# Altium schematic sheet P06 Power&GND of Hi3519.SchDoc
size 420 x 297 mm
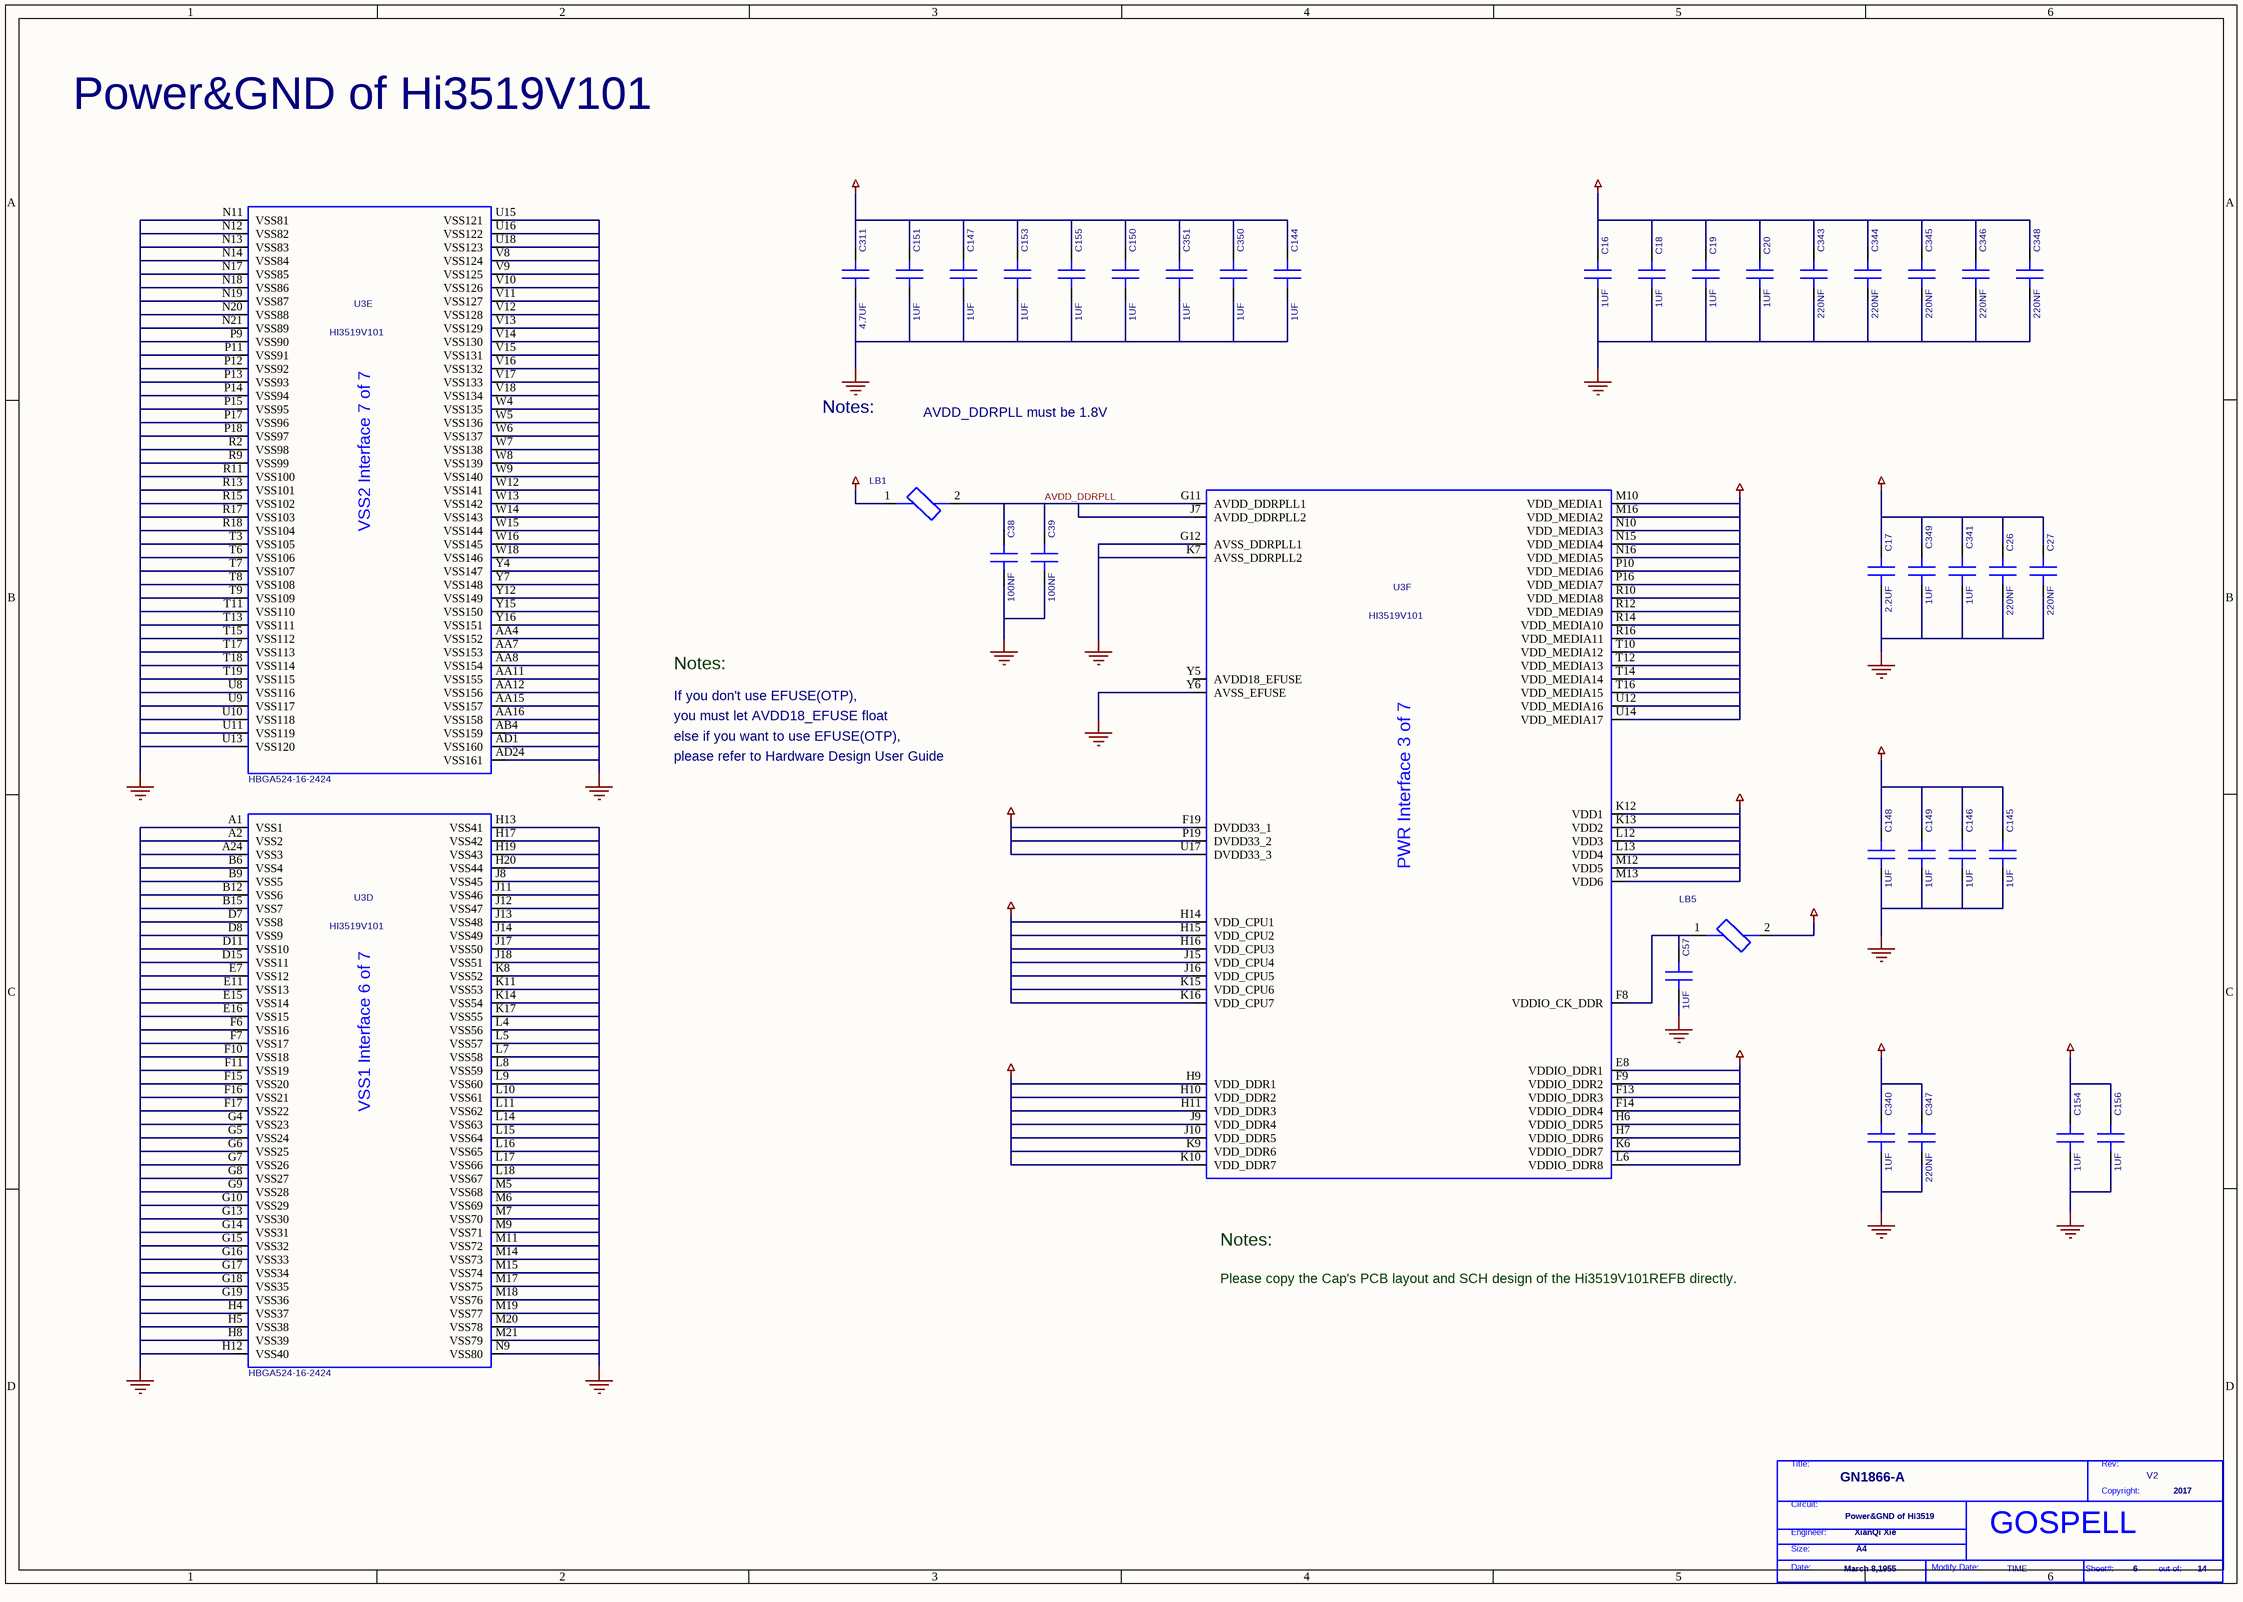
[diagram p0: P06 Power&GND of Hi3519.SchDoc]

## Parts
*  Page Modify Date: TIME  Engineer: XianQi Xie  Copyright: 2017  Title: GN1866-A  RevCode: V2  Page Size: A4  Page Create Date: March 8,1955  Page Number: 6  Page Count: 14  Doc: Power&GND of Hi3519  (hidden comment: GOSPELL)  (graphical)
C16  1UF  [HSC0201]
C17  2.2UF  [SC0402]
C18  1UF  [HSC0201]
C19  1UF  [HSC0201]
C20  1UF  [HSC0201]
C26  220NF  [HSC0201]
C27  220NF  [HSC0201]
C38  100NF  [HSC0201]
C39  100NF  [HSC0201]
C57  1UF  [HSC0201]
C144  1UF  [HSC0201]
C145  1UF  [HSC0201]
C146  1UF  [HSC0201]
C147  1UF  [HSC0201]
C148  1UF  [HSC0201]
C149  1UF  [HSC0201]
C150  1UF  [HSC0201]
C151  1UF  [HSC0201]
C153  1UF  [HSC0201]
C154  1UF  [HSC0201]
C155  1UF  [HSC0201]
C156  1UF  [HSC0201]
C311  4.7UF  [SC0402]
C340  1UF  [HSC0201]
C341  1UF  [HSC0201]
C343  220NF  [HSC0201]
C344  220NF  [HSC0201]
C345  220NF  [HSC0201]
C346  220NF  [HSC0201]
C347  220NF  [HSC0201]
C348  220NF  [HSC0201]
C349  1UF  [HSC0201]
C350  1UF  [HSC0201]
C351  1UF  [HSC0201]
LB1  LB  [HSL0201-TB]  (value not drawn)
LB5  LB  [HSL0201-TB]  (value not drawn)
U3  DEVICE: HI3519V101  [HBGA524-16-2424]  (hidden comment: HI3519V101_PER)  (parts D,E,F of 7)

## Nets
1V8: LB1.1
1V35/1V5: C144.1(A) C147.1(A) C150.1(A) C151.1(A) C153.1(A) C155.1(A) C311.1(A) C350.1(A) C351.1(A) LB5.2 U3.E8(VDDIO_DDR1) U3.F9(VDDIO_DDR2) U3.F13(VDDIO_DDR3) U3.F14(VDDIO_DDR4) U3.H6(VDDIO_DDR5) U3.H7(VDDIO_DDR6) U3.K6(VDDIO_DDR7) U3.L6(VDDIO_DDR8)
3V3: C145.1(A) C146.1(A) C148.1(A) C149.1(A) U3.F19(DVDD33_1) U3.P19(DVDD33_2) U3.U17(DVDD33_3)
GND: C16.2(B) C17.2(B) C18.2(B) C19.2(B) C20.2(B) C26.2(B) C27.2(B) C38.2(B) C39.2(B) C57.2(B) C144.2(B) C145.2(B) C146.2(B) C147.2(B) C148.2(B) C149.2(B) C150.2(B) C151.2(B) C153.2(B) C154.2(B) C155.2(B) C156.2(B) C311.2(B) C340.2(B) C341.2(B) C343.2(B) C344.2(B) C345.2(B) C346.2(B) C347.2(B) C348.2(B) C349.2(B) C350.2(B) C351.2(B) U3.A1(VSS1) U3.A2(VSS2) U3.A24(VSS3) U3.AA4(VSS152) U3.AA7(VSS153) U3.AA8(VSS154) U3.AA11(VSS155) U3.AA12(VSS156) U3.AA15(VSS157) U3.AA16(VSS158) U3.AB4(VSS159) U3.AD1(VSS160) U3.AD24(VSS161) U3.B6(VSS4) U3.B9(VSS5) U3.B12(VSS6) U3.B15(VSS7) U3.D7(VSS8) U3.D8(VSS9) U3.D11(VSS10) U3.D15(VSS11) U3.E7(VSS12) U3.E11(VSS13) U3.E15(VSS14) U3.E16(VSS15) U3.F6(VSS16) U3.F7(VSS17) U3.F10(VSS18) U3.F11(VSS19) U3.F15(VSS20) U3.F16(VSS21) U3.F17(VSS22) U3.G4(VSS23) U3.G5(VSS24) U3.G6(VSS25) U3.G7(VSS26) U3.G8(VSS27) U3.G9(VSS28) U3.G10(VSS29) U3.G12(AVSS_DDRPLL1) U3.G13(VSS30) U3.G14(VSS31) U3.G15(VSS32) U3.G16(VSS33) U3.G17(VSS34) U3.G18(VSS35) U3.G19(VSS36) U3.H4(VSS37) U3.H5(VSS38) U3.H8(VSS39) U3.H12(VSS40) U3.H13(VSS41) U3.H17(VSS42) U3.H19(VSS43) U3.H20(VSS44) U3.J8(VSS45) U3.J11(VSS46) U3.J12(VSS47) U3.J13(VSS48) U3.J14(VSS49) U3.J17(VSS50) U3.J18(VSS51) U3.K7(AVSS_DDRPLL2) U3.K8(VSS52) U3.K11(VSS53) U3.K14(VSS54) U3.K17(VSS55) U3.L4(VSS56) U3.L5(VSS57) U3.L7(VSS58) U3.L8(VSS59) U3.L9(VSS60) U3.L10(VSS61) U3.L11(VSS62) U3.L14(VSS63) U3.L15(VSS64) U3.L16(VSS65) U3.L17(VSS66) U3.L18(VSS67) U3.M5(VSS68) U3.M6(VSS69) U3.M7(VSS70) U3.M9(VSS71) U3.M11(VSS72) U3.M14(VSS73) U3.M15(VSS74) U3.M17(VSS75) U3.M18(VSS76) U3.M19(VSS77) U3.M20(VSS78) U3.M21(VSS79) U3.N9(VSS80) U3.N11(VSS81) U3.N12(VSS82) U3.N13(VSS83) U3.N14(VSS84) U3.N17(VSS85) U3.N18(VSS86) U3.N19(VSS87) U3.N20(VSS88) U3.N21(VSS89) U3.P9(VSS90) U3.P11(VSS91) U3.P12(VSS92) U3.P13(VSS93) U3.P14(VSS94) U3.P15(VSS95) U3.P17(VSS96) U3.P18(VSS97) U3.R2(VSS98) U3.R9(VSS99) U3.R11(VSS100) U3.R13(VSS101) U3.R15(VSS102) U3.R17(VSS103) U3.R18(VSS104) U3.T3(VSS105) U3.T6(VSS106) U3.T7(VSS107) U3.T8(VSS108) U3.T9(VSS109) U3.T11(VSS110) U3.T13(VSS111) U3.T15(VSS112) U3.T17(VSS113) U3.T18(VSS114) U3.T19(VSS115) U3.U8(VSS116) U3.U9(VSS117) U3.U10(VSS118) U3.U11(VSS119) U3.U13(VSS120) U3.U15(VSS121) U3.U16(VSS122) U3.U18(VSS123) U3.V8(VSS124) U3.V9(VSS125) U3.V10(VSS126) U3.V11(VSS127) U3.V12(VSS128) U3.V13(VSS129) U3.V14(VSS130) U3.V15(VSS131) U3.V16(VSS132) U3.V17(VSS133) U3.V18(VSS134) U3.W4(VSS135) U3.W5(VSS136) U3.W6(VSS137) U3.W7(VSS138) U3.W8(VSS139) U3.W9(VSS140) U3.W12(VSS141) U3.W13(VSS142) U3.W14(VSS143) U3.W15(VSS144) U3.W16(VSS145) U3.W18(VSS146) U3.Y4(VSS147) U3.Y6(AVSS_EFUSE) U3.Y7(VSS148) U3.Y12(VSS149) U3.Y15(VSS150) U3.Y16(VSS151)
VCC_CPU_CORE: C17.1(A) C26.1(A) C27.1(A) C341.1(A) C349.1(A) U3.H14(VDD_CPU1) U3.H15(VDD_CPU2) U3.H16(VDD_CPU3) U3.J15(VDD_CPU4) U3.J16(VDD_CPU5) U3.K15(VDD_CPU6) U3.K16(VDD_CPU7)
VCC_MEDIA_CORE: C16.1(A) C18.1(A) C19.1(A) C20.1(A) C343.1(A) C344.1(A) C345.1(A) C346.1(A) C348.1(A) U3.M10(VDD_MEDIA1) U3.M16(VDD_MEDIA2) U3.N10(VDD_MEDIA3) U3.N15(VDD_MEDIA4) U3.N16(VDD_MEDIA5) U3.P10(VDD_MEDIA6) U3.P16(VDD_MEDIA7) U3.R10(VDD_MEDIA8) U3.R12(VDD_MEDIA9) U3.R14(VDD_MEDIA10) U3.R16(VDD_MEDIA11) U3.T10(VDD_MEDIA12) U3.T12(VDD_MEDIA13) U3.T14(VDD_MEDIA14) U3.T16(VDD_MEDIA15) U3.U12(VDD_MEDIA16) U3.U14(VDD_MEDIA17)
VCC_VDD_DDR_CORE: C154.1(A) C156.1(A) C340.1(A) C347.1(A) U3.H9(VDD_DDR1) U3.H10(VDD_DDR2) U3.H11(VDD_DDR3) U3.J9(VDD_DDR4) U3.J10(VDD_DDR5) U3.K9(VDD_DDR6) U3.K10(VDD_DDR7) U3.K12(VDD1) U3.K13(VDD2) U3.L12(VDD3) U3.L13(VDD4) U3.M12(VDD5) U3.M13(VDD6)
AVDD_DDRPLL: C38.1(A) C39.1(A) LB1.2 U3.G11(AVDD_DDRPLL1) U3.J7(AVDD_DDRPLL2)
NetC57_1: C57.1(A) LB5.1 U3.F8(VDDIO_CK_DDR)

Not connected (* = marked no-connect by the designer): U3 Y5(AVDD18_EFUSE)

## Notes on the sheet
- Power&GND of Hi3519V101
- Notes:
- AVDD_DDRPLL must be 1.8V
- you must let AVDD18_EFUSE float
- If you don't use EFUSE(OTP),
- please refer to Hardware Design User Guide
- else if you want to use EFUSE(OTP),
- Please copy the Cap's PCB layout and SCH design of the Hi3519V101REFB directly.
- (in symbol GOSPELL) Title:; Rev:; Copyright:; Circuit:; Engineer:; Size:; Date:; Modify Date:; Sheet#:; out of:
- (in symbol HI3519V101_PER_2, part D) VSS1 Interface 6 of 7
- (in symbol HI3519V101_PER_2, part E) VSS2 Interface 7 of 7
- (in symbol HI3519V101_PER_2, part F) PWR Interface 3 of 7

## Library data of the parts
C16 C18 C20 C340 = C_0_Dup2: PARTS: 1; OriginalSymbolOrigin: (0,30); DEVICE: CM03X5R105M06AH_A; LEVEL: STD; PINSWAP: (A,B); %208%%161%%192%%224%%195%%251%%179%%198%: SMD陶瓷电容; COMPONENT_HIGH_MAX: 0.35MM; %182%%238%%182%%168%%185%%164%%215%%247%%181%%231%%209%%185%(V): 6.3; %195%%232%%202%%246%: SMD陶瓷电容-4V-1000NF-+/-20%-X5R-0201(0.65MM*0.35MM*0.35MM)-终端专用; CODE: 8071128; GVALUE: C  4V  1uF +80%~-20%  X5R 0201(0.65MM*0.35MM*0.35MM); PKG_TYPE: HSC0201
C17 = C_0_Dup2: PARTS: 1; OriginalSymbolOrigin: (0,30); DEVICE: GRM155R60J225ME15D; LEVEL: STD; PINSWAP: (A,B); %208%%161%%192%%224%%195%%251%%179%%198%: SMD陶瓷电容; COMPONENT_HIGH_MAX: 0.6MM; %182%%238%%182%%168%%185%%164%%215%%247%%181%%231%%209%%185%(V): 6.3; %195%%232%%202%%246%: SMD陶瓷电容-6.3V-2200NF-+/-20%-X5R-0402-TS16949; CODE: 8070667; GVALUE: C  6.3V  2.2uF +80%~-20%  X5R 0402; PKG_TYPE: SC0402
C19 = C_0_Dup2: PARTS: 1; OriginalSymbolOrigin: (0,30); DEVICE: CM03X5R105M06AH_A; LEVEL: STD; PINSWAP: (A,B); GVALUE: C  4V  1uF +80%~-20%  X5R 0201(0.65MM*0.35MM*0.35MM); %208%%161%%192%%224%%195%%251%%179%%198%: SMD陶瓷电容; COMPONENT_HIGH_MAX: 0.35MM; %182%%238%%182%%168%%185%%164%%215%%247%%181%%231%%209%%185%(V): 6.3; %195%%232%%202%%246%: SMD陶瓷电容-4V-1000NF-+/-20%-X5R-0201(0.65MM*0.35MM*0.35MM)-终端专用; CODE: 8071128; PKG_TYPE: HSC0201
C26 C344 C346 = C_0_Dup2: PARTS: 1; OriginalSymbolOrigin: (0,30); DEVICE: GRM033R60J104KE19D; LEVEL: STD; PINSWAP: (A,B); CODE: 8070752; %195%%232%%202%%246%: SMD陶瓷电容-6.3V-220NF-+/-20%-X5R-0201-终端专用-终端专用; %182%%238%%182%%168%%185%%164%%215%%247%%181%%231%%209%%185%(V): 6.3; COMPONENT_HIGH_MAX: 0.33MM; %208%%161%%192%%224%%195%%251%%179%%198%: SMD陶瓷电容; GVALUE: C  6.3V  0.22uF +80%~-20%  X5R 0201; PKG_TYPE: HSC0201
C27 C343 C345 C347 C348 = C_0_Dup2: PARTS: 1; OriginalSymbolOrigin: (0,30); DEVICE: GRM033R60J104KE19D; LEVEL: STD; PINSWAP: (A,B); %208%%161%%192%%224%%195%%251%%179%%198%: SMD陶瓷电容; COMPONENT_HIGH_MAX: 0.33MM; %182%%238%%182%%168%%185%%164%%215%%247%%181%%231%%209%%185%(V): 6.3; %195%%232%%202%%246%: SMD陶瓷电容-6.3V-220NF-+/-20%-X5R-0201-终端专用-终端专用; CODE: 8070752; GVALUE: C  6.3V  0.22uF +80%~-20%  X5R 0201; PKG_TYPE: HSC0201
C38 = C_0_Dup2: PARTS: 1; OriginalSymbolOrigin: (0,30); DEVICE: GRM033R60J104KE19D; LEVEL: STD; PINSWAP: (A,B); CODE: 8070704; %195%%232%%202%%246%: SMD陶瓷电容-6.3V-100NF-+/-10%-X5R-0201-TS16949; %182%%238%%182%%168%%185%%164%%215%%247%%181%%231%%209%%185%(V): 6.3; COMPONENT_HIGH_MAX: 0.33MM; %208%%161%%192%%224%%195%%251%%179%%198%: SMD陶瓷电容; GVALUE: C  6.3V  0.1uF +80%~-20%  X5R 0201; PKG_TYPE: HSC0201
C39 = C_0_Dup2: PARTS: 1; OriginalSymbolOrigin: (0,30); DEVICE: GRM033R60J104KE19D; LEVEL: STD; PINSWAP: (A,B); %208%%161%%192%%224%%195%%251%%179%%198%: SMD陶瓷电容; COMPONENT_HIGH_MAX: 0.33MM; %182%%238%%182%%168%%185%%164%%215%%247%%181%%231%%209%%185%(V): 6.3; %195%%232%%202%%246%: SMD陶瓷电容-6.3V-100NF-+/-10%-X5R-0201-TS16949; CODE: 8070704; GVALUE: C  6.3V  0.1uF +80%~-20%  X5R 0201; PKG_TYPE: HSC0201
C57 C144 C148 C151 C153 C155 C350 C351 = C_0_Dup2: PARTS: 1; OriginalSymbolOrigin: (0,30); DEVICE: CM03X5R105M06AH_A; LEVEL: STD; PINSWAP: (A,B); CODE: 8071128; %195%%232%%202%%246%: SMD陶瓷电容-4V-1000NF-+/-20%-X5R-0201(0.65MM*0.35MM*0.35MM)-终端专用; %182%%238%%182%%168%%185%%164%%215%%247%%181%%231%%209%%185%(V): 10; COMPONENT_HIGH_MAX: 0.35MM; %208%%161%%192%%224%%195%%251%%179%%198%: SMD陶瓷电容; GVALUE: C  4V  1uF +80%~-20%  X5R 0201(0.65MM*0.35MM*0.35MM); PKG_TYPE: HSC0201
C145 C147 C149 C150 C156 C341 C349 = C_0_Dup2: PARTS: 1; OriginalSymbolOrigin: (0,30); DEVICE: CM03X5R105M06AH_A; LEVEL: STD; PINSWAP: (A,B); %208%%161%%192%%224%%195%%251%%179%%198%: SMD陶瓷电容; COMPONENT_HIGH_MAX: 0.35MM; %182%%238%%182%%168%%185%%164%%215%%247%%181%%231%%209%%185%(V): 10; %195%%232%%202%%246%: SMD陶瓷电容-4V-1000NF-+/-20%-X5R-0201(0.65MM*0.35MM*0.35MM)-终端专用; CODE: 8071128; GVALUE: C  4V  1uF +80%~-20%  X5R 0201(0.65MM*0.35MM*0.35MM); PKG_TYPE: HSC0201
C146 C154 = C_0_Dup2: PARTS: 1; OriginalSymbolOrigin: (0,30); DEVICE: CM03X5R105M06AH_A; LEVEL: STD; PINSWAP: (A,B); GVALUE: C  4V  1uF +80%~-20%  X5R 0201(0.65MM*0.35MM*0.35MM); %208%%161%%192%%224%%195%%251%%179%%198%: SMD陶瓷电容; COMPONENT_HIGH_MAX: 0.35MM; %182%%238%%182%%168%%185%%164%%215%%247%%181%%231%%209%%185%(V): 10; %195%%232%%202%%246%: SMD陶瓷电容-4V-1000NF-+/-20%-X5R-0201(0.65MM*0.35MM*0.35MM)-终端专用; CODE: 8071128; PKG_TYPE: HSC0201
C311 = C_0_Dup2: PARTS: 1; OriginalSymbolOrigin: (0,30); DEVICE: C1005X5R0J475MTJ00F; LEVEL: STD; PINSWAP: (A,B); %208%%161%%192%%224%%195%%251%%179%%198%: SMD陶瓷电容; COMPONENT_HIGH_MAX: 0.65MM; %182%%238%%182%%168%%185%%164%%215%%247%%181%%231%%209%%185%(V): 6.3; %195%%232%%202%%246%: SMD陶瓷电容-6.3V-4700NF-+/-20%-X5R-0402; CODE: 8071610; GVALUE: C  6.3V  4.7uF +80%~-20%  X5R 0402; PKG_TYPE: SC0402
LB1 = LB_0: PARTS: 1; OriginalSymbolOrigin: (20,50); LEVEL: STD; DEVICE: NOOO; %195%%232%%202%%246%: EMI磁珠-+/-25%-1000OHM-1.25OHM-0.25A-0402-1400OHM@1GHZ; COMPONENT_HIGH_MAX: 0.65MM; %208%%161%%192%%224%%195%%251%%179%%198%: EMI磁珠; CODE: 99053XWH; GVALUE: 麦捷:0201磁珠80欧; PKG_TYPE: HSL0201-TB
LB5 = LB_0: PARTS: 1; OriginalSymbolOrigin: (20,50); LEVEL: STD; DEVICE: NOOO; CODE: 99053XWH; %208%%161%%192%%224%%195%%251%%179%%198%: EMI磁珠; COMPONENT_HIGH_MAX: 0.65MM; %195%%232%%202%%246%: EMI磁珠-+/-25%-1000OHM-1.25OHM-0.25A-0402-1400OHM@1GHZ; GVALUE: 麦捷:0201磁珠80欧; PKG_TYPE: HSL0201-TB
U3 = HI3519V101_PER_2: PARTS: 1; OriginalSymbolOrigin: (0,840); LEVEL: STD; HETERO: (HI3519V101_PWR),(HI3519V101_DDR),(HI3519V101_SYS),(HI3519V101_VIVO),(HI3519V101_PER),(HI3519V101_VSS1),(HI3519V101_VSS2); CODE: G01428016_MODZH; %195%%232%%202%%246%: 请注意是HDI板，建库的时候请注意下-02323838; COMPONENT_HIGH_MAX: 0.98MM; CaptureCellPackProp: HI3519V101_PERD; FORWARD_PCB: 1; PKG_TYPE: HBGA524-16-2424; GVALUE: HI3519V101_PER
* = GOSPELL: Cage Code: 2017